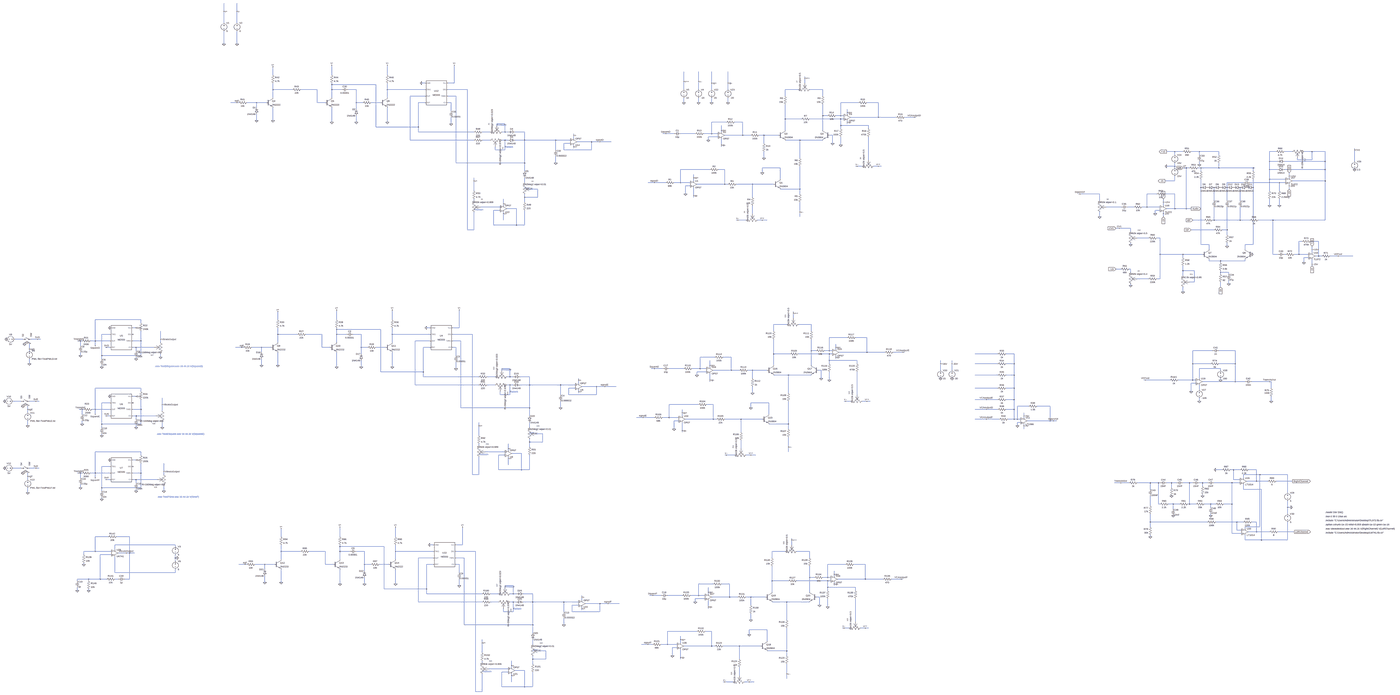
[diagram p0: schematic Test Case 3- Sequence.asc, whole sheet]
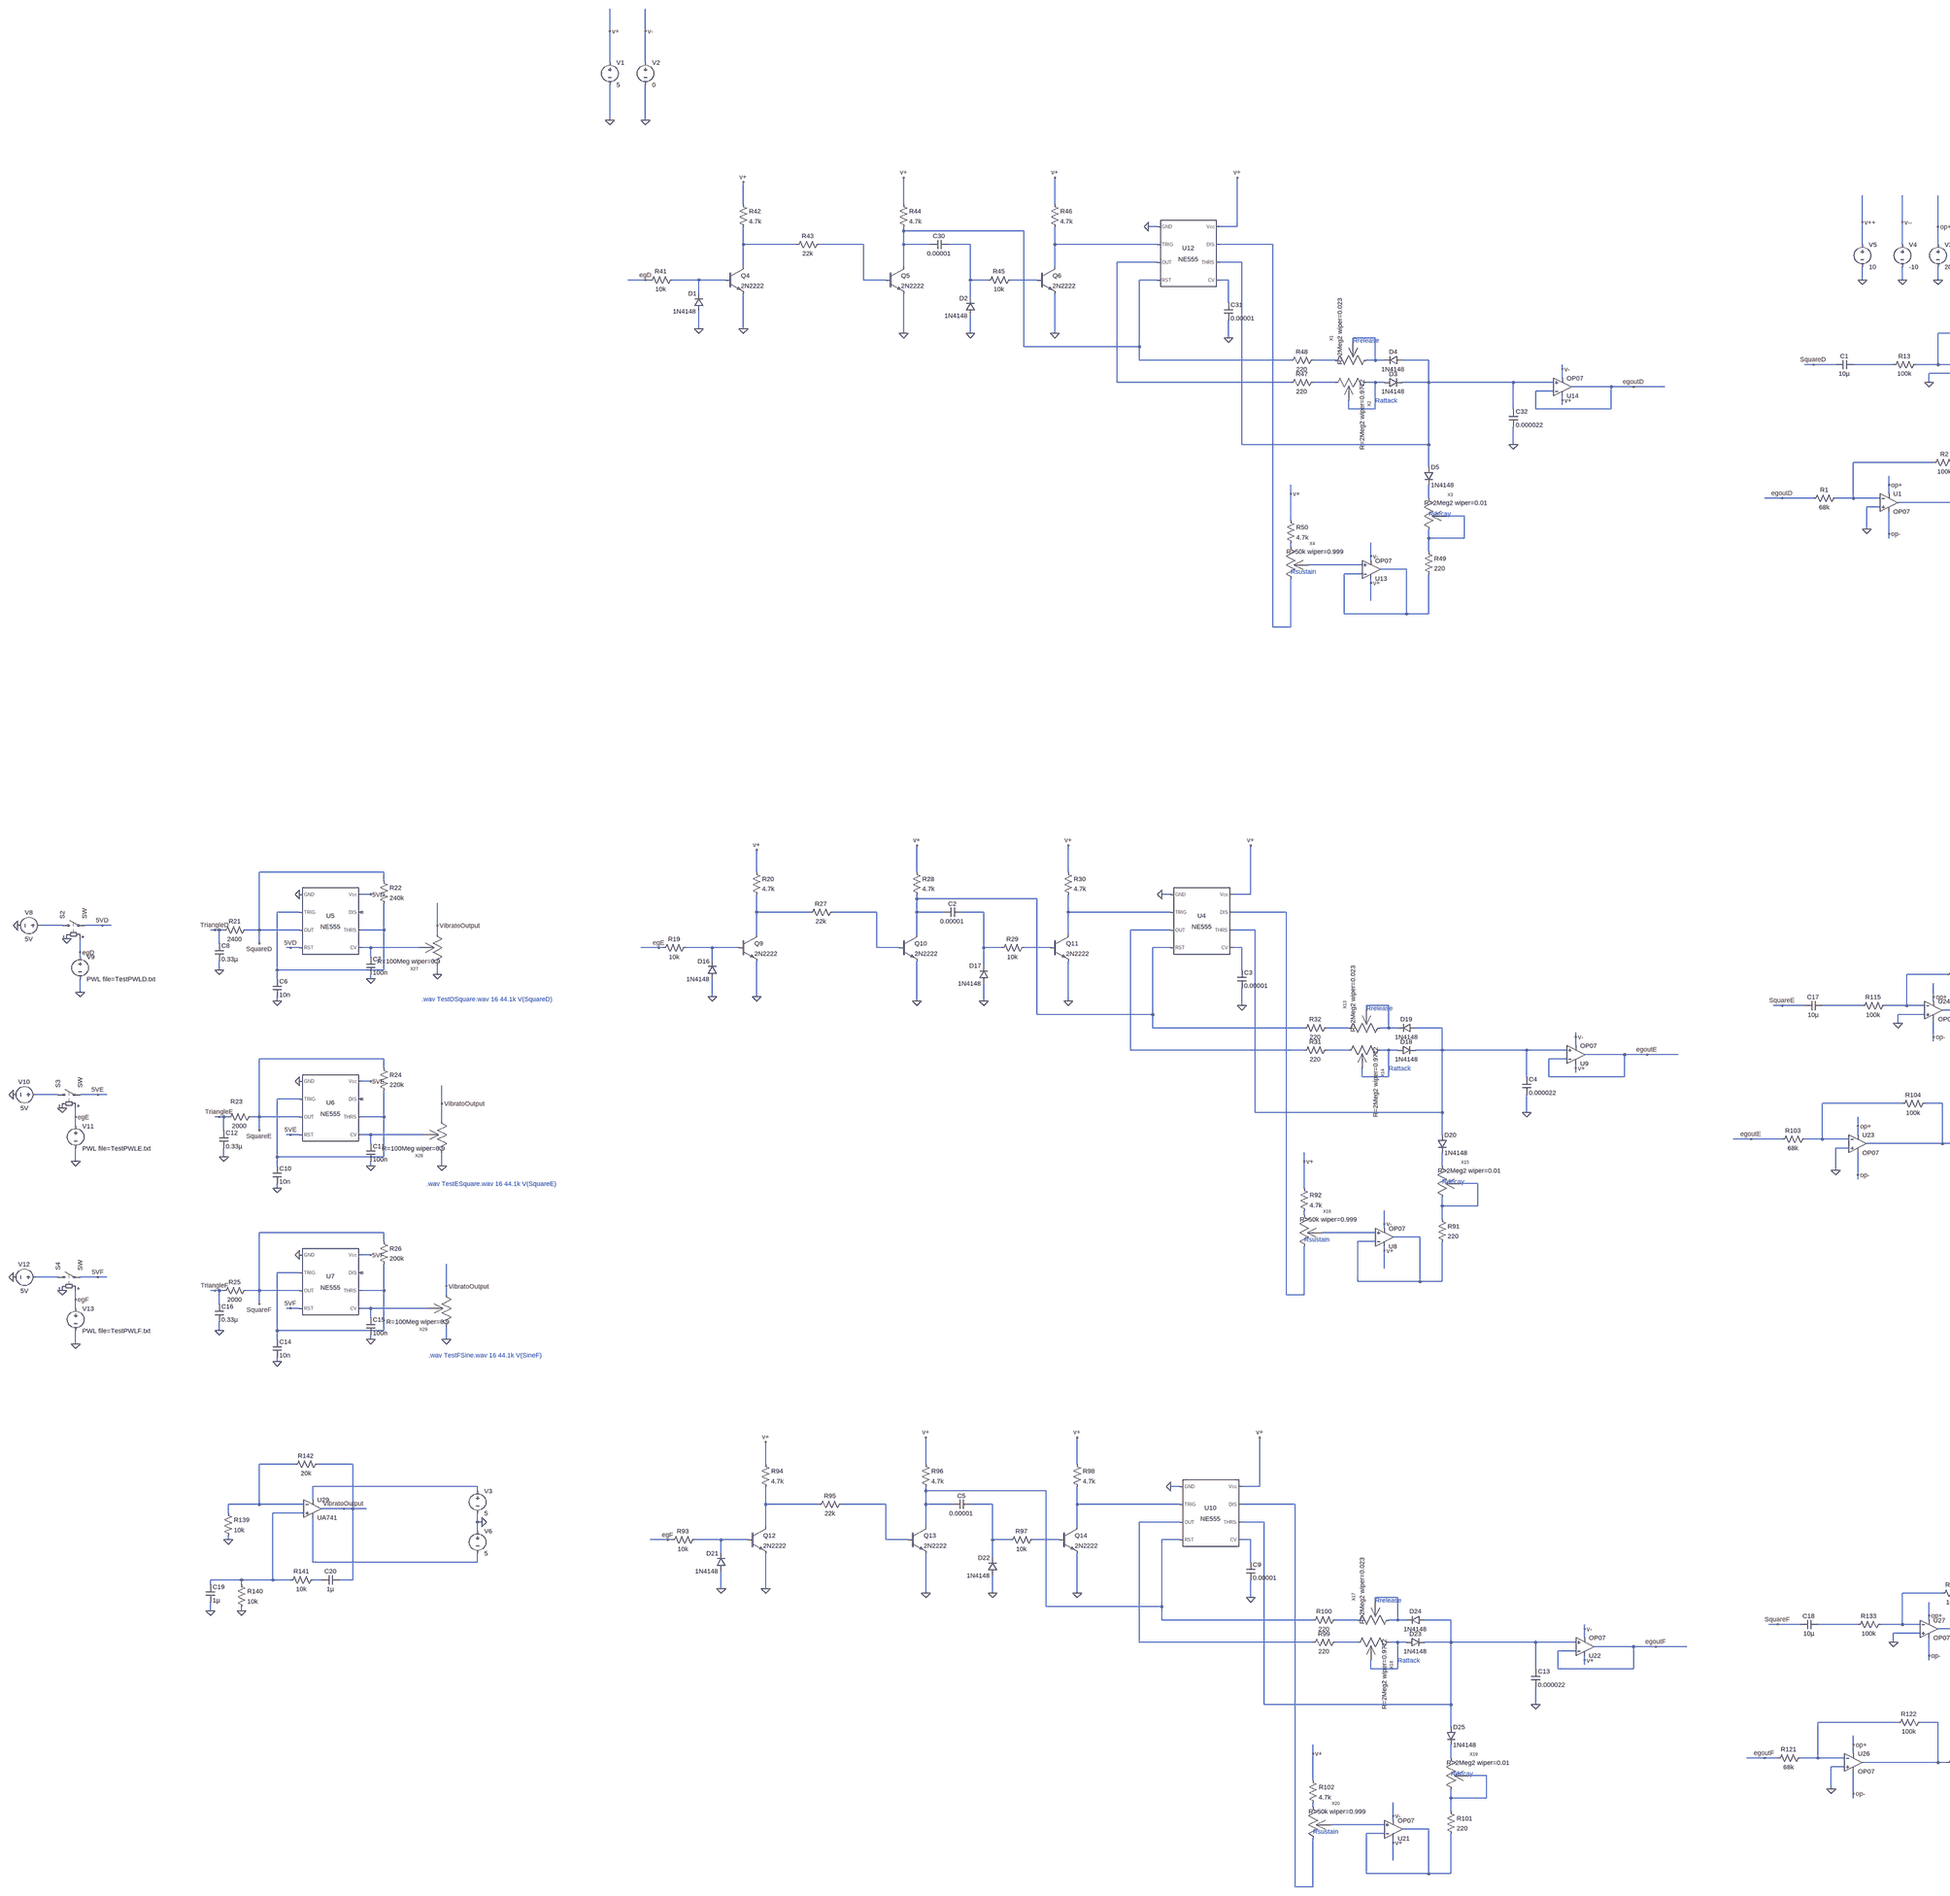
[diagram p1: schematic Test Case 3- Sequence.asc, part, row 1 of 1, column 1 of 2]
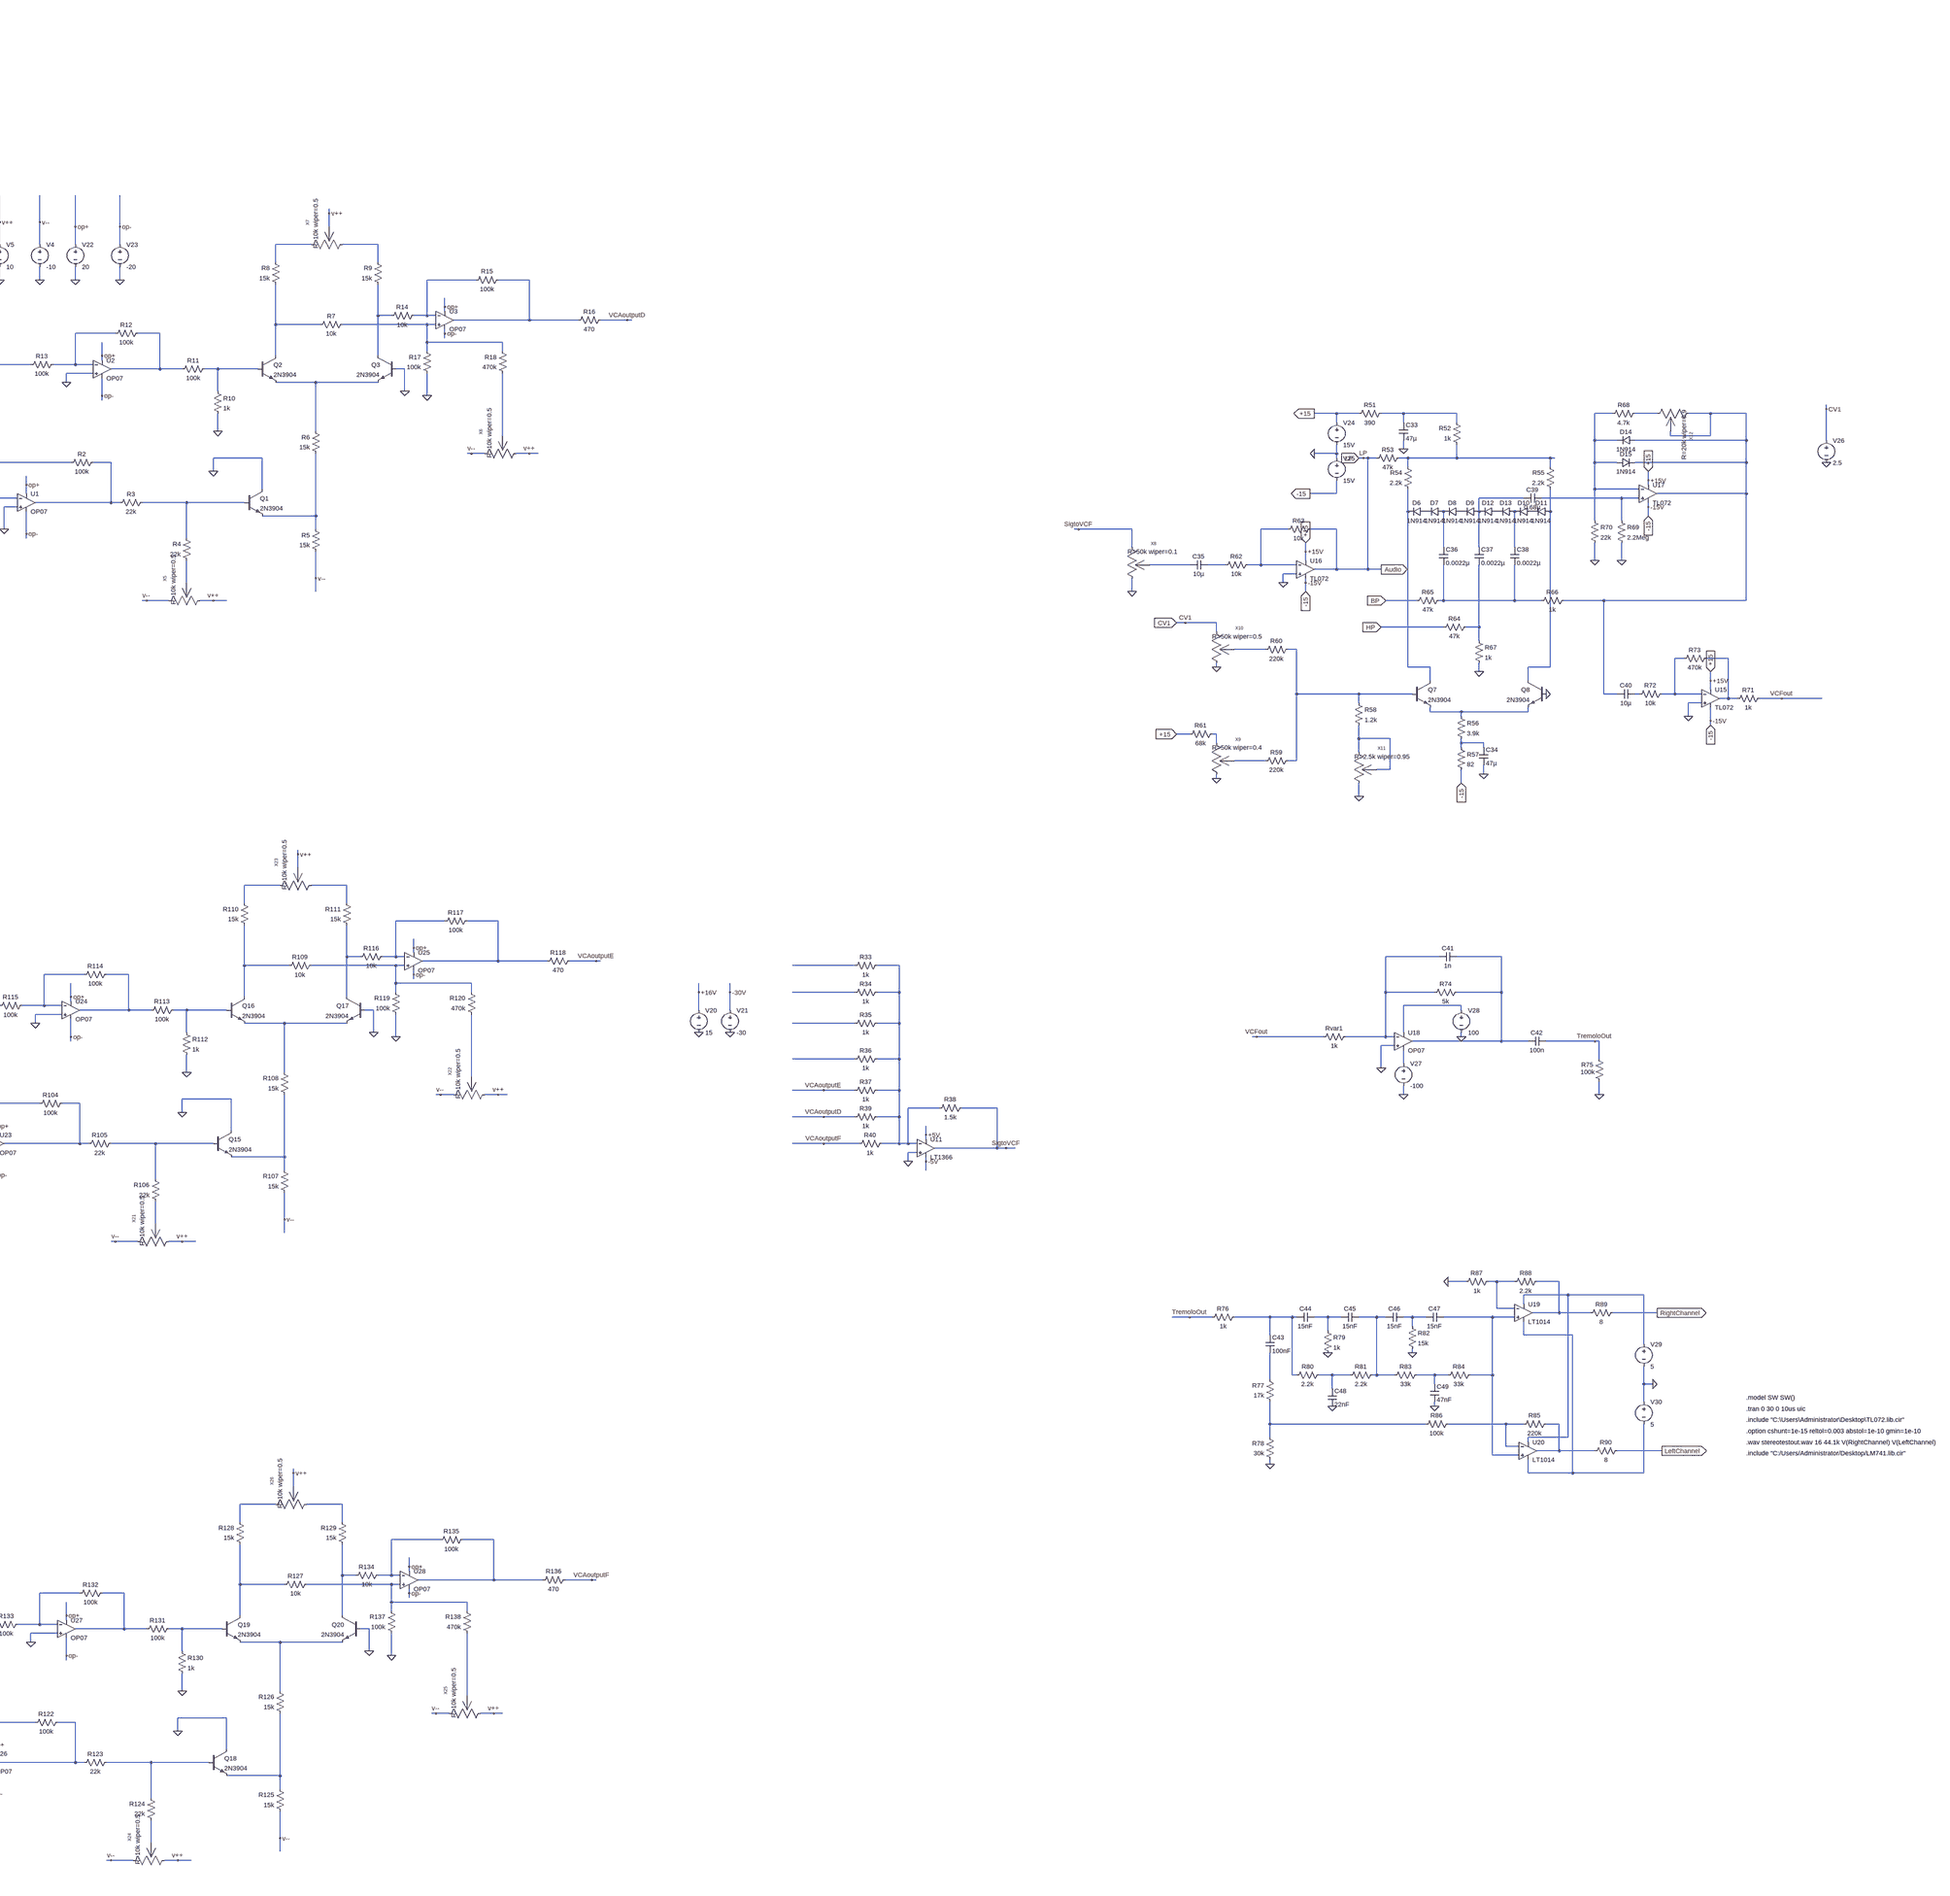
[diagram p2: schematic Test Case 3- Sequence.asc, part, row 1 of 1, column 2 of 2]
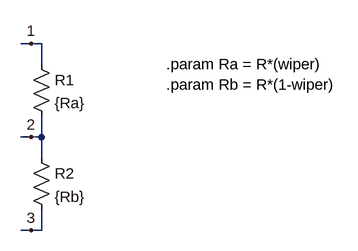
[diagram p3: sub-circuit varres.asc]
* Test Case 3- Sequence.asc
V1 v+ 0 5
V2 v- 0 0
XU1 0 N034 op+ op- N035 LT1001  ; OP07, pins In+ In- V+ V- OUT
XU2 0 N019 op+ op- N020 LT1001  ; OP07, pins In+ In- V+ V- OUT
XU3 N018 N014 op+ op- N015 LT1001  ; OP07, pins In+ In- V+ V- OUT
R1 N034 egoutD 68k
R2 N035 N034 100k
R3 N039 N035 22k
R4 N052 N039 22k
R5 v-- N043 15k
R6 N043 N027 15k
Q1 0 N039 N043 0 2N3904
Q2 N017 N024 N027 0 2N3904
Q3 N016 0 N027 0 2N3904
R7 N018 N017 10k
R8 N017 N007 15k
R9 N016 N008 15k
R10 N024 0 1k
R11 N024 N020 100k
R12 N020 N019 100k
R13 N019 N023 100k
C1 N023 SquareD 10µ
R14 N014 N016 10k
R15 N015 N014 100k
R16 VCAoutputD N015 470
R17 0 N018 100k
R18 N032 N018 470k
V4 v-- 0 -10
V5 v++ 0 10
XU5 0 N068 SquareD 5VD N079 N068 NC_01 5VD NE555  ; pins GND TRIG OUT RST CV THRS DIS Vcc
C6 N068 0 10n
R21 SquareD TriangleD 2400
C7 N079 0 100n
R22 SquareD N068 240k
C8 TriangleD 0 0.33µ
XU6 0 N106 SquareE 5VE N109 N106 NC_02 5VE NE555  ; pins GND TRIG OUT RST CV THRS DIS Vcc
C10 N106 0 10n
R23 SquareE TriangleE 2000
C11 N109 0 100n
R24 SquareE N106 220k
C12 TriangleE 0 0.33µ
XU7 0 N118 SquareF 5VF N123 N118 NC_03 5VF NE555  ; pins GND TRIG OUT RST CV THRS DIS Vcc
C14 N118 0 10n
R25 SquareF TriangleF 2000
C15 N123 0 100n
R26 SquareF N118 200k
C16 TriangleF 0 0.33µ
V8 N076 0 5V
S2 N076 5VD egD 0 SW
V9 egD 0 PWL file=TestPWLD.txt
V10 N105 0 5V
S3 N105 5VE egE 0 SW
V11 egE 0 PWL file=TestPWLE.txt
V12 N119 0 5V
S4 N119 5VF egF 0 SW
V13 egF 0 PWL file=TestPWLF.txt
XU11 0 N089 +5V -5V SigtoVCF LT1366  ; pins In+ In- V+ V- OUT
R33 N089 N088 1k
R34 N089 N092 1k
R35 N089 N098 1k
R36 N089 N102 1k
R37 N089 VCAoutputE 1k
V20 +16V 0 15
V21 -30V 0 -30
R38 SigtoVCF N089 1.5k
R39 N089 VCAoutputD 1k
R40 N089 VCAoutputF 1k
V22 op+ 0 20
V23 op- 0 -20
R41 N011 egD 10k
D1 0 N011 1N4148
Q4 N002 N011 0 0 2N2222
R42 v+ N002 4.7k
R43 N003 N002 22k
Q5 N001 N003 0 0 2N2222
R44 v+ N001 4.7k
C30 N004 N001 0.00001
D2 0 N004 1N4148
R45 N012 N004 10k
Q6 N005 N012 0 0 2N2222
R46 v+ N005 4.7k
XU12 0 N005 N009 N001 N013 N010 N006 v+ NE555  ; pins GND TRIG OUT RST CV THRS DIS Vcc
R47 N025 N009 220
D3 N026 N010 1N4148
R48 N022 N001 220
D4 N010 N021 1N4148
D5 N010 N036 1N4148
R49 N042 N051 220
XU13 N048 N051 v+ v- N051 LT1001  ; OP07, pins In+ In- V+ V- OUT
R50 v+ N045 4.7k
C31 N013 0 0.00001
XU14 N010 egoutD v+ v- egoutD LT1001  ; OP07, pins In+ In- V+ V- OUT
C32 N010 0 0.000022
XX1 N021 N021 N022 varres params: R=2Meg2 wiper=0.023
XX2 N025 N026 N026 varres params: R=2Meg2 wiper=0.9772
XX3 N042 N042 N036 varres params: R=2Meg2 wiper=0.01
XX4 N006 N048 N045 varres params: R=50k wiper=0.999
XX5 v++ N052 v-- varres params: R=10k wiper=0.5
XX6 v++ N032 v-- varres params: R=10k wiper=0.5
XX7 N008 v++ N007 varres params: R=10k wiper=0.5
V24 +15V 0 15V
V25 0 -15V 15V
R51 N028 +15V 390
R52 N033 N028 1k
C33 N028 0 47µ
R53 N033 LP 47k
R54 N040 N033 2.2k
R55 N041 N033 2.2k
D6 P001 N040 1N914
D7 N046 P001 1N914
D8 P002 N046 1N914
D9 N037 P002 1N914
D10 P003 N047 1N914
D11 N041 P003 1N914
Q7 N040 N056 N060 0 2N3904
Q8 N041 0 N060 0 2N3904
R56 N060 N063 3.9k
R57 N063 -15V 82
C34 N063 0 47µ
R58 N056 N062 1.2k
R59 N056 N064 220k
R60 N056 N055 220k
R61 N061 +15V 68k
R62 N044 N050 10k
R63 LP N044 10k
C35 N050 N049 10µ
D12 P004 N037 1N914
D13 N047 P004 1N914
R64 N054 HP 47k
R65 N053 BP 47k
C36 N046 N053 0.0022µ
C37 N037 N054 0.0022µ
C38 N047 N053 0.0022µ
R66 N031 N053 1k
C39 N038 N037 0.68µ
R67 N054 0 1k
D14 N031 N029 1N914
D15 N029 N031 1N914
R68 N030 N029 4.7k
R69 N038 0 2.2Meg
R70 N029 0 22k
R71 VCFout N058 1k
C40 N059 N031 10µ
R72 N057 N059 10k
R73 N058 N057 470k
XU15 0 N057 +15V -15V N058 TL072  ; pins In+ In- V+ V- OUT
XU16 0 N044 +15V -15V LP TL072  ; pins In+ In- V+ V- OUT
XU17 N038 N029 +15V -15V N031 TL072  ; pins In+ In- V+ V- OUT
V26 CV1 0 2.5
XX8 0 N049 SigtoVCF varres params: R=50k wiper=0.1
XX9 0 N064 N061 varres params: R=50k wiper=0.4
XX10 0 N055 CV1 varres params: R=50k wiper=0.5
XX11 0 N062 N062 varres params: R=2.5k wiper=0.95
XX12 N030 N031 N031 varres params: R=20k wiper=0.9
Rvar1 N084 VCFout 1k
R74 N085 N084 5k
R75 0 TremoloOut 100k
C41 N085 N084 1n
C42 TremoloOut N085 100n
XU18 0 N084 N095 N103 N085 LT1001  ; OP07, pins In+ In- V+ V- OUT
V27 N103 0 -100
V28 N095 0 100
R76 N124 TremoloOut 1k
R77 N133 N132 17k
R78 0 N133 30k
C43 N124 N132 100nF
C44 N125 N124 15nF
C45 N126 N125 15nF
C46 N127 N126 15nF
C47 N128 N127 15nF
R79 N125 0 1k
R80 N130 N124 2.2k
R81 N126 N130 2.2k
C48 N130 0 22nF
R82 N127 0 15k
R83 N131 N126 33k
R84 N128 N131 33k
C49 N131 0 47nF
XU19 N128 N120 N122 N129 N121 LT1014  ; pins In+ In- V+ V- OUT
XU20 N128 N134 N122 N129 N135 LT1014  ; pins In+ In- V+ V- OUT
R85 N135 N134 220k
R86 N134 N133 100k
R87 N120 0 1k
R88 N121 N120 2.2k
V29 N122 0 5
V30 0 N129 5
R89 RightChannel N121 8
R90 LeftChannel N135 8
R19 N080 egE 10k
D16 0 N080 1N4148
Q9 N069 N080 0 0 2N2222
R20 v+ N069 4.7k
R27 N070 N069 22k
Q10 N067 N070 0 0 2N2222
R28 v+ N067 4.7k
C2 N071 N067 0.00001
D17 0 N071 1N4148
R29 N081 N071 10k
Q11 N072 N081 0 0 2N2222
R30 v+ N072 4.7k
XU4 0 N072 N077 N067 N082 N078 N073 v+ NE555  ; pins GND TRIG OUT RST CV THRS DIS Vcc
R31 N100 N077 220
D18 N101 N078 1N4148
R32 N099 N067 220
D19 N078 N093 1N4148
D20 N078 N112 1N4148
R91 N113 N117 220
XU8 N116 N117 v+ v- N117 LT1001  ; OP07, pins In+ In- V+ V- OUT
R92 v+ N114 4.7k
C3 N082 0 0.00001
XU9 N078 egoutE v+ v- egoutE LT1001  ; OP07, pins In+ In- V+ V- OUT
C4 N078 0 0.000022
XX13 N093 N093 N099 varres params: R=2Meg2 wiper=0.023
XX14 N100 N101 N101 varres params: R=2Meg2 wiper=0.9772
XX15 N113 N113 N112 varres params: R=2Meg2 wiper=0.01
XX16 N073 N116 N114 varres params: R=50k wiper=0.999
R93 N149 egF 10k
D21 0 N149 1N4148
Q12 N139 N149 0 0 2N2222
R94 v+ N139 4.7k
R95 N140 N139 22k
Q13 N138 N140 0 0 2N2222
R96 v+ N138 4.7k
C5 N141 N138 0.00001
D22 0 N141 1N4148
R97 N150 N141 10k
Q14 N142 N150 0 0 2N2222
R98 v+ N142 4.7k
XU10 0 N142 N147 N138 N151 N148 N143 v+ NE555  ; pins GND TRIG OUT RST CV THRS DIS Vcc
R99 N165 N147 220
D23 N166 N148 1N4148
R100 N162 N138 220
D24 N148 N161 1N4148
D25 N148 N171 1N4148
R101 N173 N177 220
XU21 N176 N177 v+ v- N177 LT1001  ; OP07, pins In+ In- V+ V- OUT
R102 v+ N175 4.7k
C9 N151 0 0.00001
XU22 N148 egoutF v+ v- egoutF LT1001  ; OP07, pins In+ In- V+ V- OUT
C13 N148 0 0.000022
XX17 N161 N161 N162 varres params: R=2Meg2 wiper=0.023
XX18 N165 N166 N166 varres params: R=2Meg2 wiper=0.9772
XX19 N173 N173 N171 varres params: R=2Meg2 wiper=0.01
XX20 N143 N176 N175 varres params: R=50k wiper=0.999
XU23 0 N107 op+ op- N108 LT1001  ; OP07, pins In+ In- V+ V- OUT
XU24 0 N090 op+ op- N091 LT1001  ; OP07, pins In+ In- V+ V- OUT
XU25 N087 N074 op+ op- N075 LT1001  ; OP07, pins In+ In- V+ V- OUT
R103 N107 egoutE 68k
R104 N108 N107 100k
R105 N110 N108 22k
R106 N115 N110 22k
R107 v-- N111 15k
R108 N111 N097 15k
Q15 0 N110 N111 0 2N3904
Q16 N086 N096 N097 0 2N3904
Q17 N083 0 N097 0 2N3904
R109 N087 N086 10k
R110 N086 N065 15k
R111 N083 N066 15k
R112 N096 0 1k
R113 N096 N091 100k
R114 N091 N090 100k
R115 N090 N094 100k
C17 N094 SquareE 10µ
R116 N074 N083 10k
R117 N075 N074 100k
R118 VCAoutputE N075 470
R119 0 N087 100k
R120 N104 N087 470k
XX21 v++ N115 v-- varres params: R=10k wiper=0.5
XX22 v++ N104 v-- varres params: R=10k wiper=0.5
XX23 N066 v++ N065 varres params: R=10k wiper=0.5
XU26 0 N169 op+ op- N170 LT1001  ; OP07, pins In+ In- V+ V- OUT
XU27 0 N159 op+ op- N160 LT1001  ; OP07, pins In+ In- V+ V- OUT
XU28 N158 N152 op+ op- N153 LT1001  ; OP07, pins In+ In- V+ V- OUT
R121 N169 egoutF 68k
R122 N170 N169 100k
R123 N172 N170 22k
R124 N178 N172 22k
R125 v-- N174 15k
R126 N174 N167 15k
Q18 0 N172 N174 0 2N3904
Q19 N157 N164 N167 0 2N3904
Q20 N155 0 N167 0 2N3904
R127 N158 N157 10k
R128 N157 N144 15k
R129 N155 N145 15k
R130 N164 0 1k
R131 N164 N160 100k
R132 N160 N159 100k
R133 N159 N163 100k
C18 N163 SquareF 10µ
R134 N152 N155 10k
R135 N153 N152 100k
R136 VCAoutputF N153 470
R137 0 N158 100k
R138 N168 N158 470k
XX24 v++ N178 v-- varres params: R=10k wiper=0.5
XX25 v++ N168 v-- varres params: R=10k wiper=0.5
XX26 N145 v++ N144 varres params: R=10k wiper=0.5
XU29 N146 N136 N137 N154 VibratoOutput UA741  ; pins In+ In- V+ V- OUT
R139 N136 0 10k
C19 N146 0 1µ
C20 VibratoOutput N156 1µ
R140 N146 0 10k
R141 N156 N146 10k
R142 VibratoOutput N136 20k
V3 N137 0 5
V6 0 N154 5
XX27 VibratoOutput N079 0 varres params: R=100Meg wiper=0.9
XX28 VibratoOutput N109 0 varres params: R=100Meg wiper=0.9
XX29 VibratoOutput N123 0 varres params: R=100Meg wiper=0.9

* block symbol definitions
.subckt varres 3 2 1
R1 1 2 {Ra}
R2 2 3 {Rb}
.param Ra = R*(wiper)
.param Rb = R*(1-wiper)
.ends varres

.model D D
.lib standard.dio
.model NPN NPN
.model PNP PNP
.lib standard.bjt
* .wav TestDSquare.wav 16 44.1k V(SquareD)
* .wav TestESquare.wav 16 44.1k V(SquareE)
* .wav TestFSine.wav 16 44.1k V(SineF)
.model SW SW()
* Rattack
* Rrelease
* Rdecay
* Rsustain
.include "C:\Users\Administrator\Desktop\TL072.lib.cir"
.tran 0 30 0 10us uic
.option cshunt=1e-15 reltol=0.003 abstol=1e-10 gmin=1e-10
.wav stereotestout.wav 16 44.1k V(RightChannel) V(LeftChannel)
* Rattack
* Rrelease
* Rdecay
* Rsustain
* Rattack
* Rrelease
* Rdecay
* Rsustain
.include "C:/Users/Administrator/Desktop/LM741.lib.cir"
.lib LTC.lib
.lib NE555.sub
.backanno
.end